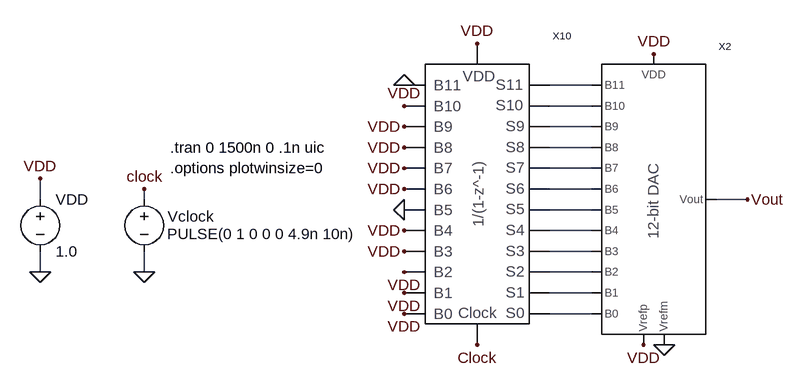
[diagram p0: schematic _Integrator_roll_around_down.asc]
_Integrator_roll_around_down.asc, the LTspice schematic file:
Version 4
SHEET 1 2740 696
WIRE 1472 -560 1408 -560
WIRE 1472 -528 1408 -528
WIRE 1472 -496 1408 -496
WIRE 1472 -464 1408 -464
WIRE 1472 -432 1408 -432
WIRE 1472 -400 1408 -400
WIRE 624 -384 624 -416
WIRE 784 -384 784 -400
WIRE 1712 -384 1664 -384
WIRE 1472 -368 1408 -368
WIRE 1472 -336 1408 -336
WIRE 1472 -304 1408 -304
WIRE 624 -272 624 -304
WIRE 784 -272 784 -304
WIRE 1472 -272 1408 -272
WIRE 1472 -240 1408 -240
WIRE 1472 -208 1408 -208
FLAG 784 -272 0
FLAG 784 -400 clock
FLAG 624 -272 0
FLAG 624 -416 VDD
FLAG 1712 -384 Vout
FLAG 1568 -608 VDD
FLAG 1584 -160 0
FLAG 1552 -160 VDD
FLAG 1296 -624 VDD
FLAG 1296 -160 Clock
FLAG 1184 -560 0
FLAG 1184 -368 0
FLAG 1184 -528 VDD
FLAG 1184 -496 VDD
FLAG 1184 -464 VDD
FLAG 1184 -432 VDD
FLAG 1184 -400 VDD
FLAG 1184 -336 VDD
FLAG 1184 -304 VDD
FLAG 1184 -272 VDD
FLAG 1184 -240 VDD
FLAG 1184 -208 VDD
SYMBOL voltage 784 -400 R0
WINDOW 0 36 42 Left 0
WINDOW 3 35 69 Left 0
WINDOW 123 0 0 Left 0
WINDOW 39 0 0 Left 0
SYMATTR InstName Vclock
SYMATTR Value PULSE(0 1 0 0 0 4.9n 10n)
SYMBOL voltage 624 -400 R0
WINDOW 123 0 0 Left 0
WINDOW 39 0 0 Left 0
SYMATTR InstName VDD
SYMATTR Value 1.0
SYMBOL Ideal_12_bit_DAC 1488 -176 R0
SYMATTR InstName X2
SYMBOL 12_bit_integrator 1216 -192 R0
SYMATTR InstName X10
TEXT 824 -464 Left 0 !.tran 0 1500n 0 .1n uic
TEXT 824 -432 Left 0 !.options plotwinsize=0

The netlist it stands for:
* _Integrator_roll_around_down.asc
Vclock clock 0 PULSE(0 1 0 0 0 4.9n 10n)
VDD VDD 0 1.0
XX2 N001 N002 N003 N004 N005 N006 N007 N008 N009 N010 N011 N012 Vout VDD 0 VDD Ideal_12_bit_DAC  ; pins B11 B10 B9 B8 B7 B6 B5 B4 B3 B2 B1 B0 Vout Vrefp Vrefm VDD
XX10 VDD VDD VDD VDD VDD 0 VDD VDD VDD VDD VDD 0 N012 N011 N010 N009 N008 N007 N006 N005 N004 N003 N002 N001 clock VDD 12_bit_integrator  ; pins B0 B1 B2 B3 B4 B5 B6 B7 B8 B9 B10 B11 S0 S1 S2 S3 S4 S5 S6 S7 S8 S9 S10 S11 Clock VDD
.tran 0 1500n 0 .1n uic
.options plotwinsize=0
.backanno
.end